# Altium schematic sheet Fastino_FPGA_LVDS.SchDoc: Fastino
size 420 x 297 mm; EDA_Number: ARTIQ; Projet: Fastino; Author: G.Kasprowicz; CompanyName: WUT ISE; DrawnBy: G.Kasprowicz; Organization: WUT ISE; Address1: PW ISE; Address2: Nowowiejska 15/19 00-665 Warsaw; Address3: gkasprow@gmail.com; DocumentNumber: 4; Revision: 2; SheetNumber: 6; SheetTotal: 12; ModifiedBy: -; CheckedDate: -; Title2: FPGA EEM connections; DivGrp: WUT ISE; Designer: G.Kasprowicz; SPICEModelCacheRFUWQEQD: <root> / <DocumentId>RFUWQEQD</DocumentId> / <CacheFrame Number="0"> / <Model Name="pk14" Kind="CKT"> / <Text>*.INC dhvqfn.s / .SUBCKT pk14 / +    1   2   3   4   5   6   7   8   9  10 / +   11  12  13  14 / +   15  16  17  18  19  20  21  22  23  24 / +   25  26  27  28 / * Pin Resistance / r1 1 1001 9.078E-02 / r2 2 1002 8.829E-02 / r3 3 1003 8.731E-02 / r4 4 1004 8.710E-02 / r5 5 1005 8.731E-02 / r6 6 1006 8.829E-02 / r7 7 1007 9.075E-02 / r8 8 1008 9.072E-02 / r9 9 1009 8.809E-02 / r10 10 1010 8.716E-02 / r11 11 1011 8.706E-02 / r12 12 1012 8.720E-02 / r13 13 1013 8.816E-02 / r14 14 1014 9.068E-02 / * Pin Inductance / l1 1001 15 2.981E-09 / l2 1002 16 2.447E-09 / l3 1003 17 2.304E-09 / l4 1004 18 2.291E-09 / l5 1005 19 2.307E-09 / l6 1006 20 2.449E-09 / l7 1007 21 2.971E-09 / l8 1008 22 2.972E-09 / l9 1009 23 2.425E-09 / l10 1010 24 2.286E-09 / l11 1011 25 2.280E-09 / l12 1012 26 2.286E-09 / l13 1013 27 2.425E-09 / l14 1014 28 2.975E-09 / .ENDS pk14</Text> / </Model> / </CacheFrame> / </root>; ModifiedDate: -; ProjectName: Sensor Box
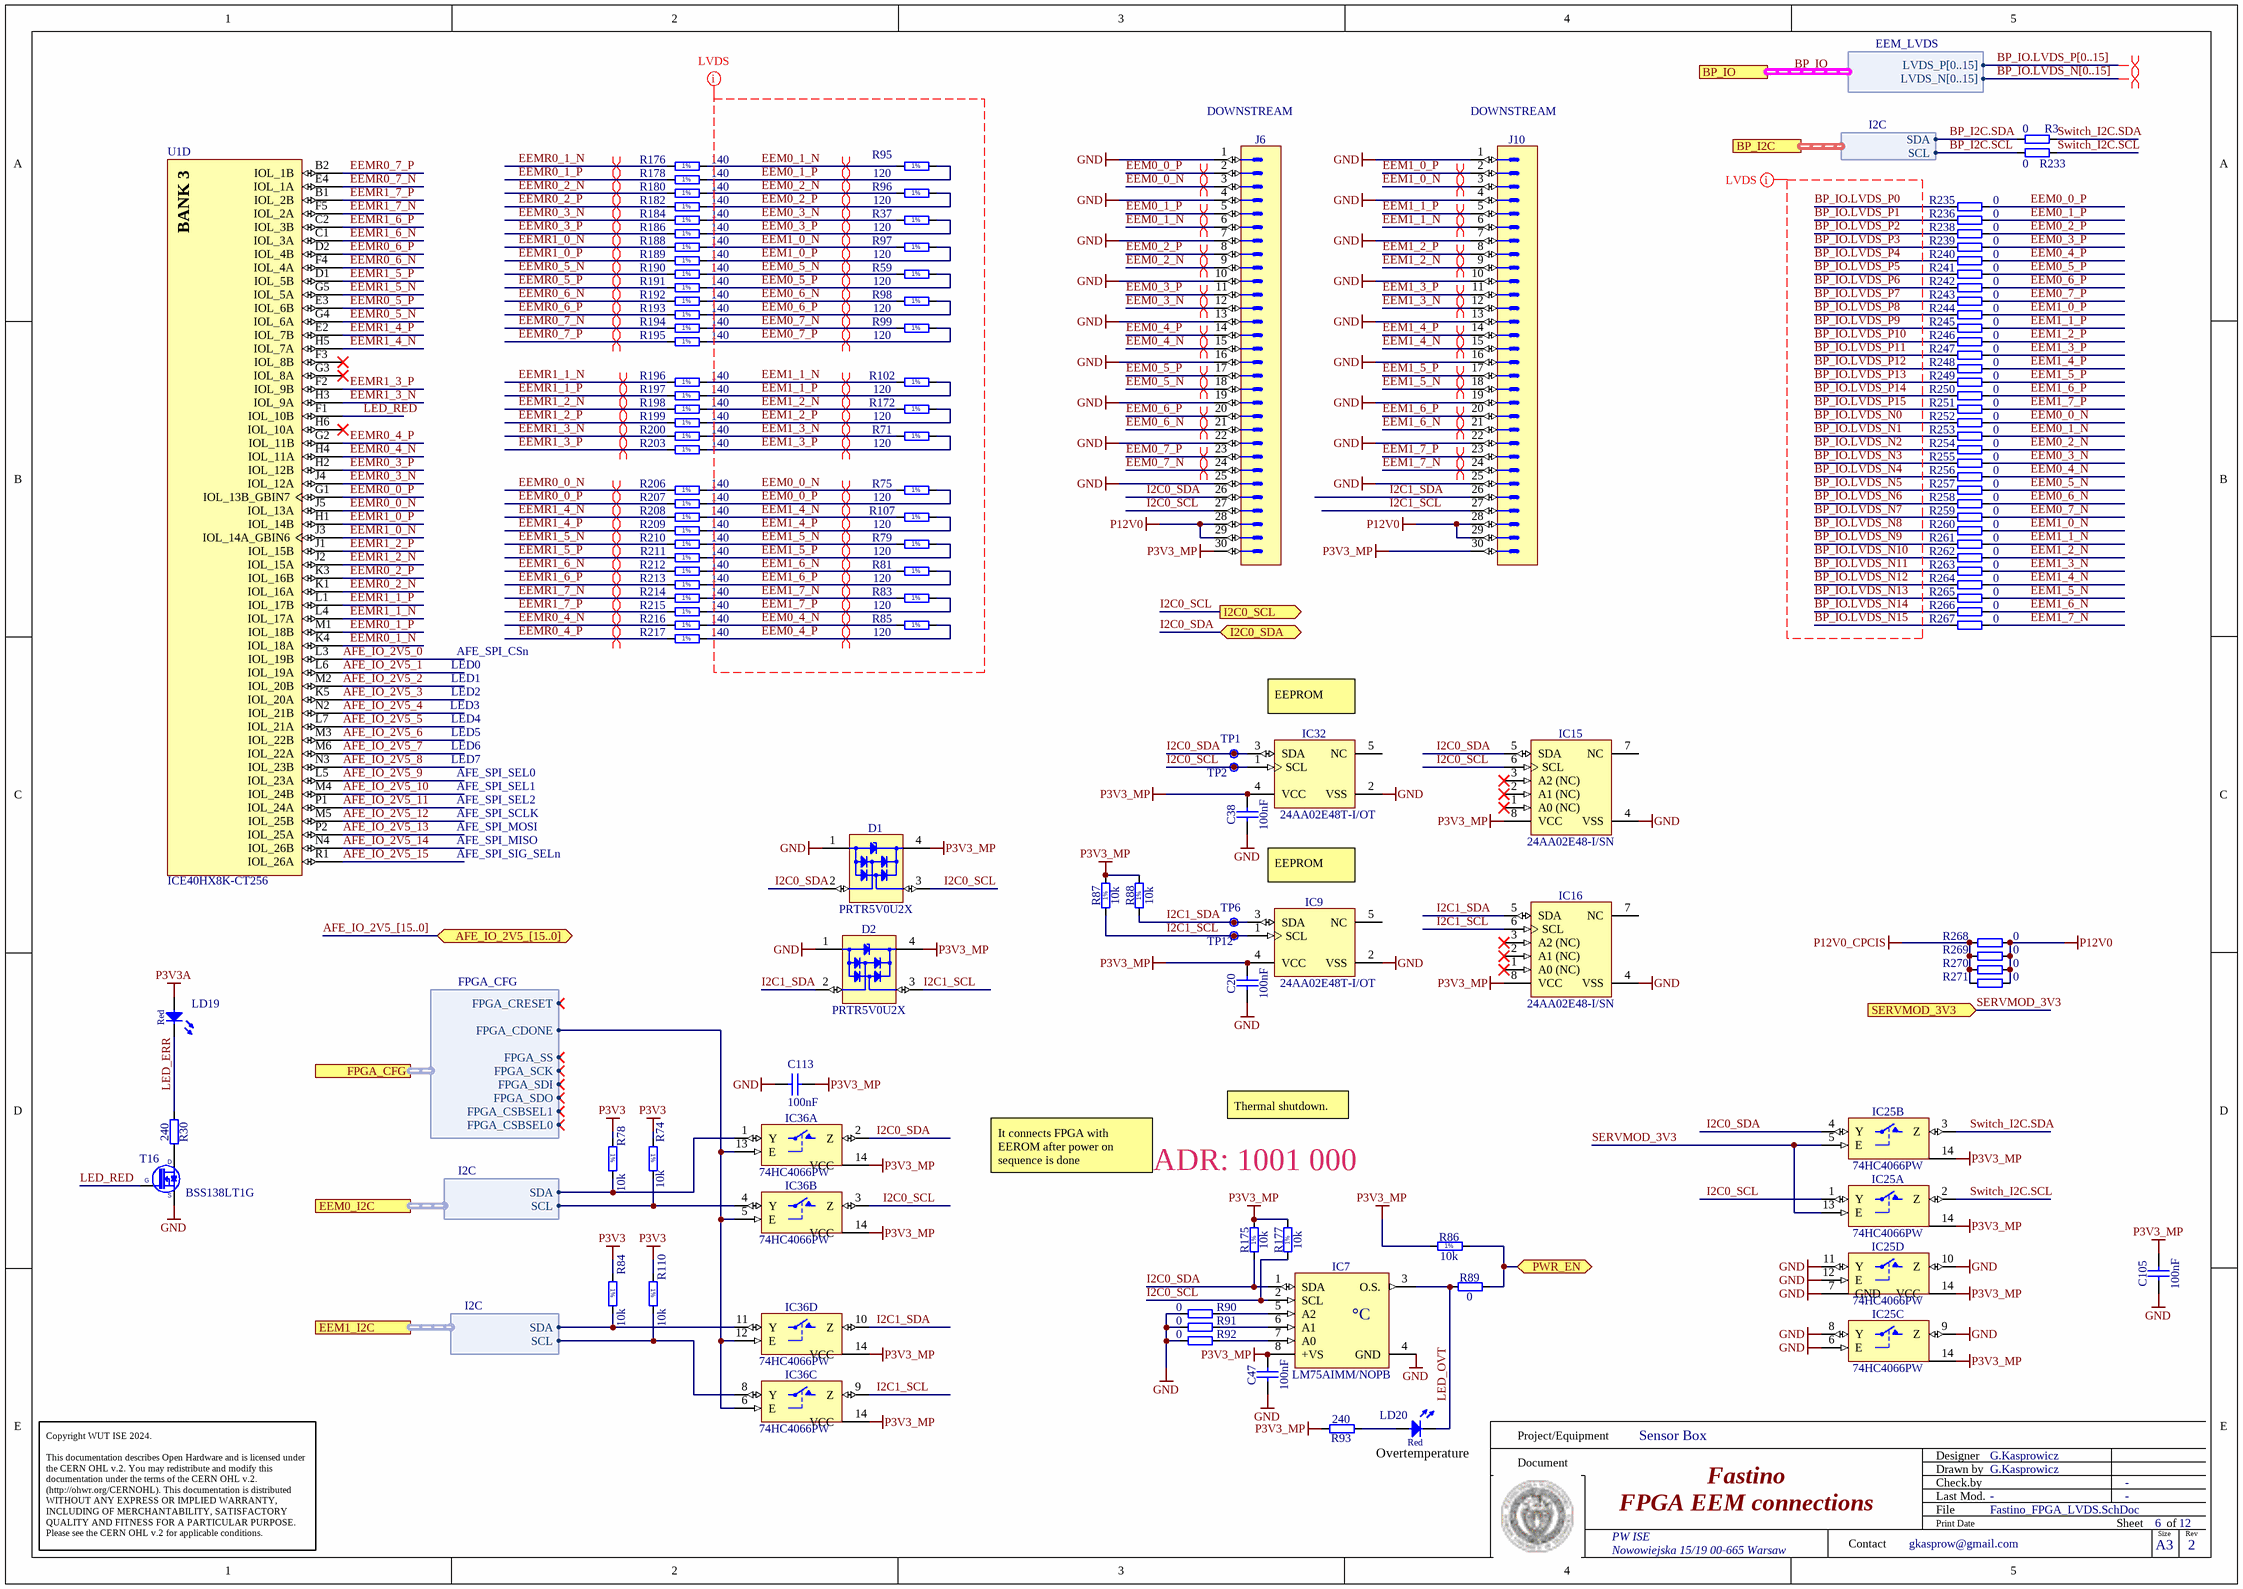
[diagram p0: Fastino_FPGA_LVDS.SchDoc]

## Parts
C20  100nF  [CAPC1005X55N]
C38  100nF  [CAPC1005X55N]
C47  100nF  [CAPC1005X55N]
C105  100nF  [CAPC1005X55N]
C113  100nF  [CAPC1005X55N]
D1  PRTR5V0U2X  [SOT190P230X110-4N]
D2  PRTR5V0U2X  [SOT190P230X110-4N]
IC7  LM75AIMM/NOPB  [SOP65P490X109-8N]
IC9  24AA02E48T-I/OT  [SOT95P280X145-5N]
IC15  24AA02E48-I/SN  [SOIC127P600X175-8N]
IC16  24AA02E48-I/SN  [SOIC127P600X175-8N]
IC25  74HC4066PW  [SOP65P640X110-14N]  (parts A,B,C,D of 4)
IC32  24AA02E48T-I/OT  [SOT95P280X145-5N]
IC36  74HC4066PW  [SOP65P640X110-14N]  (parts A,B,C,D of 4)
J6  (no value)  [3M_N2530-6002RB]
J10  (no value)  [3M_N2530-6002RB]
LD19  Red  [LED_AVAGO_HSMC-C120]
LD20  Red  [LED_AVAGO_HSMC-C120]
R3  0  [RESC1005X40N]
R30  240  [RESC1005X40N]
R37  120  [RESC1005X40N]
R59  120  [RESC1005X40N]
R71  120  [RESC1005X40N]
R74  10k  [RESC1005X40N]
R75  120  [RESC1005X40N]
R78  10k  [RESC1005X40N]
R79  120  [RESC1005X40N]
R81  120  [RESC1005X40N]
R83  120  [RESC1005X40N]
R84  10k  [RESC1005X40N]
R85  120  [RESC1005X40N]
R86  10k  [RESC1005X40N]
R87  10k  [RESC1005X40N]
R88  10k  [RESC1005X40N]
R89  0  [RESC1005X40N]
R90  0  [RESC1005X40N]
R91  0  [RESC1005X40N]
R92  0  [RESC1005X40N]
R93  240  [RESC1005X40N]
R95  120  [RESC1005X40N]
R96  120  [RESC1005X40N]
R97  120  [RESC1005X40N]
R98  120  [RESC1005X40N]
R99  120  [RESC1005X40N]
R102  120  [RESC1005X40N]
R107  120  [RESC1005X40N]
R110  10k  [RESC1005X40N]
R172  120  [RESC1005X40N]
R175  10k  [RESC1005X40N]
R176  140  [RESC0603X28N]
R177  10k  [RESC1005X40N]
R178  140  [RESC0603X28N]
R180  140  [RESC0603X28N]
R182  140  [RESC0603X28N]
R184  140  [RESC0603X28N]
R186  140  [RESC0603X28N]
R188  140  [RESC0603X28N]
R189  140  [RESC0603X28N]
R190  140  [RESC0603X28N]
R191  140  [RESC0603X28N]
R192  140  [RESC0603X28N]
R193  140  [RESC0603X28N]
R194  140  [RESC0603X28N]
R195  140  [RESC0603X28N]
R196  140  [RESC0603X28N]
R197  140  [RESC0603X28N]
R198  140  [RESC0603X28N]
R199  140  [RESC0603X28N]
R200  140  [RESC0603X28N]
R203  140  [RESC0603X28N]
R206  140  [RESC0603X28N]
R207  140  [RESC0603X28N]
R208  140  [RESC0603X28N]
R209  140  [RESC0603X28N]
R210  140  [RESC0603X28N]
R211  140  [RESC0603X28N]
R212  140  [RESC0603X28N]
R213  140  [RESC0603X28N]
R214  140  [RESC0603X28N]
R215  140  [RESC0603X28N]
R216  140  [RESC0603X28N]
R217  140  [RESC0603X28N]
R233  0  [RESC1005X40N]
R235  0  [RESC1005X40N]
R236  0  [RESC1005X40N]
R238  0  [RESC1005X40N]
R239  0  [RESC1005X40N]
R240  0  [RESC1005X40N]
R241  0  [RESC1005X40N]
R242  0  [RESC1005X40N]
R243  0  [RESC1005X40N]
R244  0  [RESC1005X40N]
R245  0  [RESC1005X40N]
R246  0  [RESC1005X40N]
R247  0  [RESC1005X40N]
R248  0  [RESC1005X40N]
R249  0  [RESC1005X40N]
R250  0  [RESC1005X40N]
R251  0  [RESC0603X28N]
R252  0  [RESC1005X40N]
R253  0  [RESC1005X40N]
R254  0  [RESC1005X40N]
R255  0  [RESC1005X40N]
R256  0  [RESC1005X40N]
R257  0  [RESC1005X40N]
R258  0  [RESC1005X40N]
R259  0  [RESC1005X40N]
R260  0  [RESC1005X40N]
R261  0  [RESC1005X40N]
R262  0  [RESC1005X40N]
R263  0  [RESC1005X40N]
R264  0  [RESC1005X40N]
R265  0  [RESC1005X40N]
R266  0  [RESC1005X40N]
R267  0  [RESC0603X28N]
R268  0  [RESC1005X40N]
R269  0  [RESC1005X40N]
R270  0  [RESC1005X40N]
R271  0  [RESC1005X40N]
T16  BSS138LT1G  [SOT95P240X110-3N]
TP1  Test Point  [TPS127]  (value not drawn)
TP2  Test Point  [TPS127]  (value not drawn)
TP6  Test Point  [TPS127]  (value not drawn)
TP12  Test Point  [TPS127]  (value not drawn)
U1  ICE40HX8K-CT256  [LATC-caBGA-256]  (part D of 5)

## Ports
AFE_IO_2V5_[15..0] (bidir), BP_I2C (harness I2C), BP_IO (harness EEM_LVDS), EEM0_I2C (harness I2C), EEM1_I2C (harness I2C), FPGA_CFG (harness FPGA_CFG), I2C0_SCL (out), I2C0_SDA (bidir), PWR_EN (bidir), SERVMOD_3V3 (in)

## Harnesses
I2C: SDA, SCL
EEM_LVDS: LVDS_P[0..15], LVDS_N[0..15]
FPGA_CFG: FPGA_CSBSEL0, FPGA_CSBSEL1, FPGA_SDO, FPGA_SDI, FPGA_SCK, FPGA_SS, FPGA_CDONE, FPGA_CRESET

## Nets
GND: C20.1 C38.1 C47.1 C105.1 C113.2 D1.1(GND) D2.1(GND) IC7.4(GND) IC9.2(VSS) IC15.4(VSS) IC16.4(VSS) IC25.6(E) IC25.7(GND) IC25.8(Y) IC25.9(Z) IC25.10(Z) IC25.11(Y) IC25.12(E) IC32.2(VSS) IC36.7(GND) J6.1 J6.4 J6.7 J6.10 J6.13 J6.16 J6.19 J6.22 J6.25 J10.1 J10.4 J10.7 J10.10 J10.13 J10.16 J10.19 J10.22 J10.25 R90.1 R91.1 R92.1 T16.2(S)
P3V3: R74.1 R78.1 R84.1 R110.1
P3V3_MP: C20.2 C38.2 C47.2 C105.2 C113.1 D1.4(VCC) D2.4(VCC) IC7.8(+VS) IC9.4(VCC) IC15.8(VCC) IC16.8(VCC) IC25.14(VCC) IC32.4(VCC) IC36.14(VCC) J6.30 J10.30 R86.1 R87.2 R88.2 R93.2 R175.2 R177.2
P3V3A: LD19.2(A)
P12V0: J6.28 J6.29 J10.28 J10.29 R268.2 R269.2 R270.2 R271.2
P12V0_CPCIS: R268.1 R269.1 R270.1 R271.1
AFE_IO_2V5_0: U1.L3(IOL_19B)
AFE_IO_2V5_1: U1.L6(IOL_19A)
AFE_IO_2V5_2: U1.M2(IOL_20B)
AFE_IO_2V5_3: U1.K5(IOL_20A)
AFE_IO_2V5_4: U1.N2(IOL_21B)
AFE_IO_2V5_5: U1.L7(IOL_21A)
AFE_IO_2V5_6: U1.M3(IOL_22B)
AFE_IO_2V5_7: U1.M6(IOL_22A)
AFE_IO_2V5_8: U1.N3(IOL_23B)
AFE_IO_2V5_9: U1.L5(IOL_23A)
AFE_IO_2V5_10: U1.M4(IOL_24B)
AFE_IO_2V5_11: U1.P1(IOL_24A)
AFE_IO_2V5_12: U1.M5(IOL_25B)
AFE_IO_2V5_13: U1.P2(IOL_25A)
AFE_IO_2V5_14: U1.N4(IOL_26B)
AFE_IO_2V5_15: U1.R1(IOL_26A)
BP_I2C.SCL: R233.1 ; port BP_I2C.SCL
BP_I2C.SDA: R3.1 ; port BP_I2C.SDA
BP_IO.LVDS_N0: R252.1
BP_IO.LVDS_N1: R253.1
BP_IO.LVDS_N2: R254.1
BP_IO.LVDS_N3: R255.1
BP_IO.LVDS_N4: R256.1
BP_IO.LVDS_N5: R257.1
BP_IO.LVDS_N6: R258.1
BP_IO.LVDS_N7: R259.1
BP_IO.LVDS_N8: R260.1
BP_IO.LVDS_N9: R261.1
BP_IO.LVDS_N10: R262.1
BP_IO.LVDS_N11: R263.1
BP_IO.LVDS_N12: R264.1
BP_IO.LVDS_N13: R265.1
BP_IO.LVDS_N14: R266.1
BP_IO.LVDS_N15: R267.2
BP_IO.LVDS_P0: R235.1
BP_IO.LVDS_P1: R236.1
BP_IO.LVDS_P2: R238.1
BP_IO.LVDS_P3: R239.1
BP_IO.LVDS_P4: R240.1
BP_IO.LVDS_P5: R241.1
BP_IO.LVDS_P6: R242.1
BP_IO.LVDS_P7: R243.1
BP_IO.LVDS_P8: R244.1
BP_IO.LVDS_P9: R245.1
BP_IO.LVDS_P10: R246.1
BP_IO.LVDS_P11: R247.1
BP_IO.LVDS_P12: R248.1
BP_IO.LVDS_P13: R249.1
BP_IO.LVDS_P14: R250.1
BP_IO.LVDS_P15: R251.2
EEM0_0_N: J6.3 R75.1 R206.2 R252.2
EEM0_0_P: J6.2 R75.2 R207.2 R235.2
EEM0_1_N: J6.6 R95.1 R176.2 R253.2
EEM0_1_P: J6.5 R95.2 R178.2 R236.2
EEM0_2_N: J6.9 R96.1 R180.2 R254.2
EEM0_2_P: J6.8 R96.2 R182.2 R238.2
EEM0_3_N: J6.12 R37.1 R184.2 R255.2
EEM0_3_P: J6.11 R37.2 R186.2 R239.2
EEM0_4_N: J6.15 R85.1 R216.2 R256.2
EEM0_4_P: J6.14 R85.2 R217.2 R240.2
EEM0_5_N: J6.18 R59.1 R190.2 R257.2
EEM0_5_P: J6.17 R59.2 R191.2 R241.2
EEM0_6_N: J6.21 R98.1 R192.2 R258.2
EEM0_6_P: J6.20 R98.2 R193.2 R242.2
EEM0_7_N: J6.24 R99.1 R194.2 R259.2
EEM0_7_P: J6.23 R99.2 R195.2 R243.2
EEM1_0_N: J10.3 R97.1 R188.2 R260.2
EEM1_0_P: J10.2 R97.2 R189.2 R244.2
EEM1_1_N: J10.6 R102.1 R196.2 R261.2
EEM1_1_P: J10.5 R102.2 R197.2 R245.2
EEM1_2_N: J10.9 R172.1 R198.2 R262.2
EEM1_2_P: J10.8 R172.2 R199.2 R246.2
EEM1_3_N: J10.12 R71.1 R200.2 R263.2
EEM1_3_P: J10.11 R71.2 R203.2 R247.2
EEM1_4_N: J10.15 R107.1 R208.2 R264.2
EEM1_4_P: J10.14 R107.2 R209.2 R248.2
EEM1_5_N: J10.18 R79.1 R210.2 R265.2
EEM1_5_P: J10.17 R79.2 R211.2 R249.2
EEM1_6_N: J10.21 R81.1 R212.2 R266.2
EEM1_6_P: J10.20 R81.2 R213.2 R250.2
EEM1_7_N: J10.24 R83.1 R214.2 R267.1
EEM1_7_P: J10.23 R83.2 R215.2 R251.1
EEMR0_0_N: R206.1 U1.J5(IOL_13A)
EEMR0_0_P: R207.1 U1.G1(IOL_13B_GBIN7)
EEMR0_1_N: R176.1 U1.K4(IOL_18A)
EEMR0_1_P: R178.1 U1.M1(IOL_18B)
EEMR0_2_N: R180.1 U1.K1(IOL_16A)
EEMR0_2_P: R182.1 U1.K3(IOL_16B)
EEMR0_3_N: R184.1 U1.J4(IOL_12A)
EEMR0_3_P: R186.1 U1.H2(IOL_12B)
EEMR0_4_N: R216.1 U1.H4(IOL_11A)
EEMR0_4_P: R217.1 U1.G2(IOL_11B)
EEMR0_5_N: R190.1 U1.G4(IOL_6A)
EEMR0_5_P: R191.1 U1.E3(IOL_6B)
EEMR0_6_N: R192.1 U1.F4(IOL_4A)
EEMR0_6_P: R193.1 U1.D2(IOL_4B)
EEMR0_7_N: R194.1 U1.E4(IOL_1A)
EEMR0_7_P: R195.1 U1.B2(IOL_1B)
EEMR1_0_N: R188.1 U1.J3(IOL_14A_GBIN6)
EEMR1_0_P: R189.1 U1.H1(IOL_14B)
EEMR1_1_N: R196.1 U1.L4(IOL_17A)
EEMR1_1_P: R197.1 U1.L1(IOL_17B)
EEMR1_2_N: R198.1 U1.J2(IOL_15A)
EEMR1_2_P: R199.1 U1.J1(IOL_15B)
EEMR1_3_N: R200.1 U1.H3(IOL_9A)
EEMR1_3_P: R203.1 U1.F2(IOL_9B)
EEMR1_4_N: R208.1 U1.H5(IOL_7A)
EEMR1_4_P: R209.1 U1.E2(IOL_7B)
EEMR1_5_N: R210.1 U1.G5(IOL_5A)
EEMR1_5_P: R211.1 U1.D1(IOL_5B)
EEMR1_6_N: R212.1 U1.C1(IOL_3A)
EEMR1_6_P: R213.1 U1.C2(IOL_3B)
EEMR1_7_N: R214.1 U1.F5(IOL_2A)
EEMR1_7_P: R215.1 U1.B1(IOL_2B)
I2C0_SCL: D1.3(I/O2) IC7.2(SCL) IC15.6(SCL) IC25.1(Y) IC32.1(SCL) IC36.3(Z) J6.27 R177.1 TP2.1 ; port I2C0_SCL
I2C0_SDA: D1.2(I/O1) IC7.1(SDA) IC15.5(SDA) IC25.4(Y) IC32.3(SDA) IC36.2(Z) J6.26 R175.1 TP1.1 ; port I2C0_SDA
I2C1_SCL: D2.3(I/O2) IC9.1(SCL) IC16.6(SCL) IC36.9(Z) J10.27 R87.1 TP12.1
I2C1_SDA: D2.2(I/O1) IC9.3(SDA) IC16.5(SDA) IC36.10(Z) J10.26 R88.1 TP6.1
LED_ERR: LD19.1(C) R30.1
LED_OVT: IC7.3(O.S.) LD20.1(C) R89.1
LED_RED: T16.1(G) U1.F1(IOL_10B)
PWR_EN: R86.2 R89.2 ; port PWR_EN
SERVMOD_3V3: IC25.5(E) IC25.13(E) ; port SERVMOD_3V3
Switch_I2C.SCL: IC25.2(Z) R233.2
Switch_I2C.SDA: IC25.3(Z) R3.2
NetIC7_5: IC7.5(A2) R90.2
NetIC7_6: IC7.6(A1) R91.2
NetIC7_7: IC7.7(A0) R92.2
NetIC36_1: IC36.1(Y) R78.2 ; port EEM0_I2C.SDA
NetIC36_4: IC36.4(Y) R74.2 ; port EEM0_I2C.SCL
NetIC36_5: IC36.5(E) IC36.6(E) IC36.12(E) IC36.13(E) ; port FPGA_CFG.FPGA_CDONE
NetIC36_8: IC36.8(Y) R110.2 ; port EEM1_I2C.SCL
NetIC36_11: IC36.11(Y) R84.2 ; port EEM1_I2C.SDA
NetLD20_2: LD20.2(A) R93.1
NetR30_2: R30.2 T16.3(D)

Not connected (* = marked no-connect by the designer): IC9 5(NC); IC15 1(A0_(NC))* 2(A1_(NC))* 3(A2_(NC))* 7(NC); IC16 1(A0_(NC))* 2(A1_(NC))* 3(A2_(NC))* 7(NC); IC32 5(NC); U1 F3(IOL_8B)* G3(IOL_8A)* H6(IOL_10A)*

## Buses and harness runs
bus AFE_IO_2V5_[15..0] = port AFE_IO_2V5_[15..0]
bus BP_IO.LVDS_N[0..15]
bus BP_IO.LVDS_P[0..15]
harness BP_IO = port BP_IO

## Layout directives
differential pair: EEM0_0_N, EEM0_0_P, EEM0_1_N, EEM0_1_P, EEM0_2_N, EEM0_2_P, EEM0_3_N, EEM0_3_P, EEM0_4_N, EEM0_4_P, EEM0_5_N, EEM0_5_P, EEM0_6_N, EEM0_6_P, EEM0_7_N, EEM0_7_P, EEM1_0_N, EEM1_0_P, EEM1_1_N, EEM1_1_P, EEM1_2_N, EEM1_2_P, EEM1_3_N, EEM1_3_P, EEM1_4_N, EEM1_4_P, EEM1_5_N, EEM1_5_P, EEM1_6_N, EEM1_6_P, EEM1_7_N, EEM1_7_P, EEMR0_0_N, EEMR0_0_P, EEMR0_1_N, EEMR0_1_P, EEMR0_2_N, EEMR0_2_P, EEMR0_3_N, EEMR0_3_P, EEMR0_4_N, EEMR0_4_P, EEMR0_5_N, EEMR0_5_P, EEMR0_6_N, EEMR0_6_P, EEMR0_7_N, EEMR0_7_P, EEMR1_0_N, EEMR1_0_P, EEMR1_1_N, EEMR1_1_P, EEMR1_2_N, EEMR1_2_P, EEMR1_3_N, EEMR1_3_P, EEMR1_4_N, EEMR1_4_P, EEMR1_5_N, EEMR1_5_P, EEMR1_6_N, EEMR1_6_P, EEMR1_7_N, EEMR1_7_P
net class LVDS: BP_IO.LVDS_N0, BP_IO.LVDS_N1, BP_IO.LVDS_N2, BP_IO.LVDS_N3, BP_IO.LVDS_N4, BP_IO.LVDS_N5, BP_IO.LVDS_N6, BP_IO.LVDS_N7, BP_IO.LVDS_N8, BP_IO.LVDS_N9, BP_IO.LVDS_N10, BP_IO.LVDS_N11, BP_IO.LVDS_N12, BP_IO.LVDS_N13, BP_IO.LVDS_N14, BP_IO.LVDS_N15, BP_IO.LVDS_P0, BP_IO.LVDS_P1, BP_IO.LVDS_P2, BP_IO.LVDS_P3, BP_IO.LVDS_P4, BP_IO.LVDS_P5, BP_IO.LVDS_P6, BP_IO.LVDS_P7, BP_IO.LVDS_P8, BP_IO.LVDS_P9, BP_IO.LVDS_P10, BP_IO.LVDS_P11, BP_IO.LVDS_P12, BP_IO.LVDS_P13, BP_IO.LVDS_P14, BP_IO.LVDS_P15, EEM0_0_N, EEM0_0_P, EEM0_1_N, EEM0_1_P, EEM0_2_N, EEM0_2_P, EEM0_3_N, EEM0_3_P, EEM0_4_N, EEM0_4_P, EEM0_5_N, EEM0_5_P, EEM0_6_N, EEM0_6_P, EEM0_7_N, EEM0_7_P, EEM1_0_N, EEM1_0_P, EEM1_1_N, EEM1_1_P, EEM1_2_N, EEM1_2_P, EEM1_3_N, EEM1_3_P, EEM1_4_N, EEM1_4_P, EEM1_5_N, EEM1_5_P, EEM1_6_N, EEM1_6_P, EEM1_7_N, EEM1_7_P
differential pair; differential pair class Diff_100Ohm: (no net found under the mark)

## Notes on the sheet
- (near J6) DOWNSTREAM
- (near J10) DOWNSTREAM
- LED0
- AFE_SPI_CSn
- LED3
- LED1
- LED4
- LED2
- EEPROM
- LED5
- LED7
- LED6
- AFE_SPI_SEL0
- AFE_SPI_SEL1
- AFE_SPI_SEL2
- AFE_SPI_SCLK
- AFE_SPI_MOSI
- AFE_SPI_MISO
- AFE_SPI_SIG_SELn
- Thermal shutdown.
- It connects FPGA with EEROM after power on sequence is done
- ADR: 1001 000
- Overtemperature
- Project/Equipment
- Document
- Designer
- Drawn by
- Check.by
- Copyright WUT ISE 2024.
  This documentation describes Open Hardware and is licensed under the CERN OHL v.2. You may redistribute and modify this documentation under the terms of the CERN OHL v.2. (http://ohwr.org/CERNOHL). This documentation is distributed WITHOUT ANY EXPRESS OR IMPLIED WARRANTY, INCLUDING OF MERCHANTABILITY, SATISFACTORY QUALITY AND FITNESS FOR A PARTICULAR PURPOSE. Please see the CERN OHL v.2 for applicable conditions.
- Contact
- File
- Last Mod.
- Print Date
- Sheet
- Size
- A3
- of
- Rev
- (in symbol CMP-0962-00001-1, part D) BANK 3
- (in symbol LM75AIMM/NOPB) °C
- (in symbol R0201_140R_1%_0.05W_200PPM) 1%
- (in symbol R0402_10k_1%_0.0625W_100PPM) 1%
- (in symbol R0402_10K_1%_0.0625W_100PPM) 1%
- (in symbol R0402_120R_1%_0.0625W_100PPM) 1%

## Library data of the parts
C20 C38 C47 C105 C113 = CC0402_100NF_16V_10%_X5R: Non-polarised capacitor; Part Description: SMD Multilayer Chip Ceramic Capacitor; Manufacturer: GENERIC; Manufacturer1 Part Number: GRM155R61C104KA88D; Voltage: 16V; TC: X5R; Tolerance: ±10%; Part Number: CC0402_100NF_16V_10%_X5R; Component Kind: Standard; Component Type: Standard; Pin Count: 2; Value: 100nF; Status: None; Manufacturer Part Number: CC0402_100NF_16V_10%_X5R; Case: 0402; Mounted: Yes; Socket: No; SMD: Yes; Sense: No; Manufacturer1 Example: MURATA; Manufacturer1 ComponentHeight: 0.55mm; HelpURL: \\cern.ch\dfs\Applications\Altium\Datasheets\CC0402_X5R_MURATA_GRM.pdf; Author: CERN DEM JLC; CreateDate: 10.12.2013; LatestRevisionDate: 10.12.2013
D1 D2 = PRTR5V0U2X: Ultra Low Capacitance Double Rail-to-Rail ESD Protection Diode; Part Description: Ultra Low Capacitance (1pF) Double Rail-to-Rail ESD Protection Diode (8kV); Manufacturer: NXP SEMICONDUCTORS; Voltage: 5.5V; PressFit: No; Bonding: No; Part Number: PRTR5V0U2X; Component Kind: Standard; Component Type: Standard; Device: PRTR5V0U2X; PackageDescription: SOT143B, SOT, 1.90mm Pitch; 4 Pin, 1.30mm W X 2.90mm L X 1.10mm H body, IPC Medium Density; Manufacturer Part Number: PRTR5V0U2X; Pin Count: 4; Case: SOT143B; Mounted: Yes; Socket: No; SMD: Yes; Sense: No; ComponentHeight: 1.1mm; HelpURL: \\cern.ch\dfs\Applications\Altium\Datasheets\PRTR5V0U2X.pdf; Author: CERN DEM JLC; CreateDate: 22.03.2011; LatestRevisionDate: 22.03.2011
IC7 = LM75AIMM/NOPB: Digital Temperature Sensor and Thermal Watchdog with Two-Wire Interface; Part Description: -25° to +100°C ±2°C Digital Temperature Sensor and Thermal Watchdog with Two-Wire Interface; Manufacturer: TEXAS INSTRUMENTS; PressFit: No; Bonding: No; Part Number: LM75AIMM/NOPB; Component Kind: Standard; Component Type: Standard; Device: LM75AIMM/NOPB; PackageDescription: SOP, 0.65mm pitch; 8 pin,3.00mm W X 3.00mm L X 1.09mm H bodyI, PC Medium Density; Manufacturer Part Number: LM75AIMM/NOPB; Pin Count: 8; Case: SSOP8; Mounted: Yes; Socket: No; SMD: Yes; Sense: No; ComponentHeight: 1.09mm; HelpURL: \\cern.ch\dfs\Applications\Altium\Datasheets\LM75AIMM-NOPB.pdf; Author: CERN DEM JLC; CreateDate: 15.10.2012; LatestRevisionDate: 15.10.2012
IC9 IC32 = 24AA02E48T-I/OT: 1.7V-5.5V, 2K I2C Serial EEPROM With EUI-48 Node Identity; Manufacturer: MICROCHIP TECHNOLOGY; PressFit: No; Bonding: No; Part Number: 24AA02E48T-I/OT; Component Kind: Standard; Component Type: Standard; Device: 24AA02E48T-I/OT; PackageDescription: SOT, 0.95mm pitch; 5 pin, 1.60mm W X 2.90mm L X 1.45mm H body, IPC Medium Density; Part Description: 1.7V-5.5V, 2K I2C Serial EEPROM With EUI-48 Node Identity; Manufacturer Part Number: 24AA02E48T-I/OT; Pin Count: 5; Case: SOT23-5; Mounted: Yes; Socket: No; SMD: Yes; Sense: No; ComponentHeight: 1.45mm; HelpURL: \\cern.ch\dfs\Applications\Altium\Datasheets\24AA02E48T-I-OT.pdf; Author: CERN DEM MR; CreateDate: 31.03.2016; LatestRevisionDate: 31.03.2016
IC15 IC16 = MEM_24AA02E48-I/SN: 1.7V-5.5V, 2K I2C™ Serial EEPROMs with EUI-48™ Node Identity; Manufacturer: MICROCHIP TECHNOLOGY; PressFit: No; Bonding: No; Part Number: 24AA02E48-I/SN; Component Kind: Standard; Component Type: Standard; Device: 24AA02E48-I/SN; PackageDescription: SOIC, 1.27mm Pitch; 8 Pin - Body 4x5mm, IPC Medium Density; Part Description: 1.7V-5.5V, 2K I2C™ Serial EEPROMs with EUI-48™ Node Identity; Manufacturer Part Number: 24AA02E48-I/SN; Pin Count: 8; Case: SOIC8; Mounted: Yes; Socket: No; SMD: Yes; Sense: No; ComponentHeight: 1.75mm; HelpURL: \\cern.ch\dfs\Applications\Altium\Datasheets\24AA025E48-I-SN.pdf; Author: CERN DEM MR; CreateDate: 19.07.2016; LatestRevisionDate: 19.07.2016
IC25 IC36 = 74HC4066PW: Part Description: Quad Single-Pole Single-Throw Analog Switch; Manufacturer: NXP SEMICONDUCTORS; PressFit: No; Bonding: No; Table: Standard Logic; Part Number: 74HC4066PW; Component Kind: Standard; Component Type: Standard; Device: 74HC4066PW; PackageDescription: SOP, 14-Leads, Body 4.4x5mm (max), Pitch 0.65mm, IPC Medium Density; Manufacturer Part Number: 74HC4066PW; Pin Count: 14; Case: TSSOP14; Mounted: Yes; Socket: No; SMD: Yes; ComponentHeight: 1.1mm; Author: CERN DEM JLC; HelpURL: \\cern.ch\dfs\Applications\Altium\Datasheets\74HC4066PW.pdf; CreateDate: 2014-11-19; LatestRevisionDate: 2014-11-19
J6 J10 = 3M_N2530-6002RB: Connector 30 Male; Part Description: 30 Contacts - Straight .100'' x .100'' Low Profile Four-Wall Header, 2500 Series; Manufacturer: 3M; PressFit: No; Part Number: 3M_N2530-6002RB; Component Kind: Standard; Component Type: Standard; Pin Count: 30; Family: Header 30; Mounted: Yes; Socket: No; SMD: No; Sense: No; Status: None; Manufacturer Part Number: N2530-6002RB; ComponentHeight: 10.03mm; HelpURL: \\cern.ch\dfs\Applications\Altium\Datasheets\3M_N2530-6002RB.pdf; Author: CERN DEM JLC; CreateDate: 11.02.2009; LatestRevisionDate: 11.08.2009
LD19 LD20 = LED_AVAGO_HSMC-C120: LED Red 1C 2A; Part Description: High Performance Right Angle Chip Red LED; Manufacturer: AVAGO TECHNOLOGIES; PressFit: No; Bonding: No; Part Number: LED_AVAGO_HSMC-C120; Component Kind: Standard; Component Type: Standard; Color: Red; PackageDescription: Red Chip LED, 2-Leads, Body 1.7x1.1mm, Side Emitting Package; Manufacturer Part Number: HSMC-C120; Pin Count: 2; Mounted: Yes; Socket: No; SMD: Yes; Sense: No; ComponentHeight: 0.7mm; HelpURL: \\cern.ch\dfs\Applications\Altium\Datasheets\LED_AVAGO_HSMC-C120.pdf; ComponentLink1URL: \\cern.ch\dfs\Applications\Altium\Datasheets\LED_AVAGO_HSMC-C120_DESIGN-GUIDE.pdf; ComponentLink1Description: Design Guide; Author: CERN DEM JMW; CreateDate: 22.07.2009; LatestRevisionDate: 20.06.2012
R3 R233 R235 R236 R238-R250 R252-R266 R268-R271 = R0402_0R_JUMPER: Resistor; Part Description: 1A (0.05R Max DC Resistance) Zero Ohm Jumper; Manufacturer: GENERIC; Manufacturer1 Part Number: 232270591001L; PressFit: No; Part Number: R0402_0R_JUMPER; Component Kind: Standard; Component Type: Standard; Pin Count: 2; Value: 0; Status: Not Recommended; Manufacturer Part Number: R0402_0R_JUMPER; Case: 0402; Mounted: Yes; Sense: No; Socket: No; SMD: Yes; Manufacturer1 Example: YAGEO PHYCOMP; Manufacturer1 ComponentHeight: 0.4mm; HelpURL: \\cern.ch\dfs\Applications\Altium\Datasheets\R0402_Phycomp_RC0402.pdf; Author: CERN DEM JLC; CreateDate: 03.12.2007; LatestRevisionDate: 17.10.2012
R30 R93 = R0402_240R_1%_0.0625W_100PPM: Resistor - 1%; Part Description: General Purpose Thick Film Chip Resistor; Manufacturer: GENERIC; Manufacturer1 Part Number: 232270672401L; TC: ±100ppm/°C; PressFit: No; Part Number: R0402_240R_1%_0.0625W_100PPM; Component Kind: Standard; Component Type: Standard; Pin Count: 2; Value: 240; Status: Not Recommended; Power: 0.0625W; Tolerance: ±1%; Manufacturer Part Number: R0402_240R_1%_0.0625W_100PPM; Case: 0402; Mounted: Yes; Sense: No; Socket: No; SMD: Yes; Manufacturer1 Example: YAGEO PHYCOMP; Manufacturer1 ComponentHeight: 0.4mm; HelpURL: \\cern.ch\dfs\Applications\Altium\Datasheets\R0402_Phycomp_RC0402.pdf; Author: CERN DEM JLC; CreateDate: 03.12.2007; LatestRevisionDate: 17.10.2012
R37 R59 R71 R75 R79 R81 R83 R85 R95-R99 R102 R107 R172 = R0402_120R_1%_0.0625W_100PPM: Resistor - 1%; Part Description: General Purpose Thick Film Chip Resistor; Manufacturer: GENERIC; Manufacturer1 Part Number: 232270671201L; TC: ±100ppm/°C; PressFit: No; Part Number: R0402_120R_1%_0.0625W_100PPM; Component Kind: Standard; Component Type: Standard; Pin Count: 2; Value: 120; Status: Not Recommended; Power: 0.0625W; Tolerance: ±1%; Manufacturer Part Number: R0402_120R_1%_0.0625W_100PPM; Case: 0402; Mounted: Yes; Sense: No; Socket: No; SMD: Yes; Manufacturer1 Example: YAGEO PHYCOMP; Manufacturer1 ComponentHeight: 0.4mm; HelpURL: \\cern.ch\dfs\Applications\Altium\Datasheets\R0402_Phycomp_RC0402.pdf; Author: CERN DEM JLC; CreateDate: 03.12.2007; LatestRevisionDate: 17.10.2012
R74 R78 R84 R110 = R0402_10k_1%_0.0625W_100PPM: Resistor - 1%; Part Description: General Purpose Thick Film Chip Resistor; Manufacturer: GENERIC; Manufacturer1 Part Number: 232270671003L; TC: ±100ppm/°C; PressFit: No; Part Number: R0402_10K_1%_0.0625W_100PPM; Component Kind: Standard; Component Type: Standard; Pin Count: 2; Value: 10k; Status: Not Recommended; Power: 0.0625W; Tolerance: ±1%; Manufacturer Part Number: R0402_10K_1%_0.0625W_100PPM; Case: 0402; Mounted: Yes; Sense: No; Socket: No; SMD: Yes; Manufacturer1 Example: YAGEO PHYCOMP; Manufacturer1 ComponentHeight: 0.4mm; HelpURL: \\cern.ch\dfs\Applications\Altium\Datasheets\R0402_Phycomp_RC0402.pdf; Author: CERN DEM JLC; CreateDate: 03.12.2007; LatestRevisionDate: 17.10.2012
R86-R88 R175 R177 = R0402_10K_1%_0.0625W_100PPM: Resistor - 1%; Part Description: General Purpose Thick Film Chip Resistor; Manufacturer: GENERIC; Manufacturer1 Part Number: 232270671003L; TC: ±100ppm/°C; PressFit: No; Part Number: R0402_10K_1%_0.0625W_100PPM; Component Kind: Standard; Component Type: Standard; Pin Count: 2; Value: 10k; Status: Not Recommended; Power: 0.0625W; Tolerance: ±1%; Manufacturer Part Number: R0402_10K_1%_0.0625W_100PPM; Case: 0402; Mounted: Yes; Sense: No; Socket: No; SMD: Yes; Manufacturer1 Example: YAGEO PHYCOMP; Manufacturer1 ComponentHeight: 0.4mm; HelpURL: \\cern.ch\dfs\Applications\Altium\Datasheets\R0402_Phycomp_RC0402.pdf; Author: CERN DEM JLC; CreateDate: 03.12.2007; LatestRevisionDate: 17.10.2012
R89-R92 = R0402_0R_JUMPER: Resistor; Part Description: 1A (0.05R Max DC Resistance) Zero Ohm Jumper; Manufacturer: GENERIC; Manufacturer1 Part Number: 232270591001L; Part Number: R0402_0R_JUMPER; Component Kind: Standard; Component Type: Standard; Pin Count: 2; Value: 0; Status: Not recommended; Manufacturer Part Number: R0402_0R_JUMPER; Case: 0402; Mounted: Yes; Sense: No; Socket: No; SMD: Yes; Manufacturer1 Example: YAGEO PHYCOMP; Manufacturer1 ComponentHeight: 0.4mm; HelpURL: \\cern.ch\dfs\Applications\Altium\Datasheets\R0402_Phycomp_RC0402.pdf; Author: CERN DEM JLC; CreateDate: 03.12.2007; LatestRevisionDate: 17.10.2012
R176 R178 R180 R182 R184 R186 R188-R200 R203 R206-R217 = R0201_140R_1%_0.05W_200PPM: Resistor - 1%; Part Description: Thick Film Chip Resistor; Manufacturer: GENERIC; Manufacturer1 Part Number: CRCW0201140RFNED; Power: 0.05W; TC: ±200ppm/°C; PressFit: No; Part Number: R0201_140R_1%_0.05W_200PPM; Component Kind: Standard; Component Type: Standard; Pin Count: 2; Value: 140; Status: Not Recommended; Tolerance: ±1%; Manufacturer Part Number: R0201_140R_1%_0.05W_200PPM; Case: 0201; Mounted: Yes; Sense: No; Socket: No; SMD: Yes; Manufacturer1 Example: VISHAY; Manufacturer1 ComponentHeight: 0.27mm; HelpURL: \\cern.ch\dfs\Applications\Altium\Datasheets\R0201_VISHAY_CRCW e3.pdf; Author: CERN DEM MR; CreateDate: 26/01/2016; LatestRevisionDate: 26/01/2016
R251 R267 = R0201_0R_JUMPER: Resistor; Part Description: 1A (0.05R Max DC Resistance) Zero Ohm Jumper; Manufacturer: GENERIC; Manufacturer1 Part Number: CRCW02010000Z0ED; PressFit: No; Part Number: R0201_0R_JUMPER; Component Kind: Standard; Component Type: Standard; Pin Count: 2; Value: 0; Status: Not Recommended; Manufacturer Part Number: R0201_0R_JUMPER; Case: 0201; Mounted: Yes; Sense: No; Socket: No; SMD: Yes; Manufacturer1 Example: VISHAY; Manufacturer1 ComponentHeight: 0.27mm; HelpURL: \\cern.ch\dfs\Applications\Altium\Datasheets\R0201_VISHAY_CRCW e3.pdf; Author: CERN DEM JLC; CreateDate: 2014-11-19; LatestRevisionDate: 2015-01-08
T16 = BSS138LT1G: N-CHANNEL MOSFET WITH DIODE; Part Description: 50V 200mA N-Channel Enhancement Mode Field-Effect Transistor; Manufacturer: ON SEMICONDUCTOR; PressFit: No; Bonding: No; Part Number: BSS138LT1G; Component Kind: Standard; Component Type: Standard; Device: BSS138LT1G; PackageDescription: SOT23 3-Leads, Pitch 0.95mm - Body 1.4x3mm, IPC Medium Density; Manufacturer Part Number: BSS138LT1G; Pin Count: 3; Case: SOT23-3; Mounted: Yes; Socket: No; SMD: Yes; Sense: No; ComponentHeight: 1.11mm; HelpURL: \\cern.ch\dfs\Applications\Altium\Datasheets\BSS138LT1G.pdf; Author: CERN DEM JLC; CreateDate: 23.03.2009; LatestRevisionDate: 23.03.2009
TP1 TP2 TP6 TP12 = SMD_PAD_1.27X1.27MM: Part Description: 1.27mm x 1.27mm PCB Copper Area (SMD Test Point); Mounted: No; Part Number: SMD_PAD_1.27X1.27MM; Component Kind: Standard (No BOM); Component Type: Standard (No BOM); Pin Count: 1; Family: Test Point; Socket: No; SMD: Yes; Sense: No; Status: None; ComponentHeight: 0mm; HelpURL: Undefined; Author: CERN DEM JLC; CreateDate: 12.01.2008; LatestRevisionDate: 12.01.2008; PackageDescription: 1.27mm x 1.27mm PCB Copper Area (SMD Test Point)
U1 = CMP-0962-00001-1: iCE40 HX8K Series FPGA Family, 7680 Logic Cells, 1.2 V Core, 128 K Embedded RAM Bits, 256-ball caBGA, Pb-Free, Tray; Manufacturer: Lattice Semiconductor; Supply Voltage: 1.2V; Phase-Locked Loops: 2; Logic Cells: 7680; Embedded RAM Bits: 128K; PackageReference: caBGA-256; PackageDescription: 256-Ball Chip Array Ball Grid Array, Body 14 x 14 mm, Pitch 0.8 mm; RoHS: TRUE; Packing: Tray; Mounting Technology: Surface Mount; ComponentLink3URL: http://www.latticesemi.com/lit/docs/package/pkg.pdf; ComponentLink1Description: Manufacturer URL; ComponentLink3Description: Package Specification; Code_JEDEC: MO-275; PackageVersion: Rev. 03.9, 02/2013; ComponentLink1URL: http://www.latticesemi.com/en; ComponentLink2URL: http://www.latticesemi.com/~/media/Documents/DataSheets/iCE/iCE40LPHXFamilyDataSheet.pdf; Manufacturer Part Number: ICE40HX8K-CT256; ComponentLink2Description: Datasheet; DatasheetVersion: Rev. 02.9